# Altium schematic sheet chronos-core.SchDoc
size B; SheetNumber: 2; SheetTotal: 9
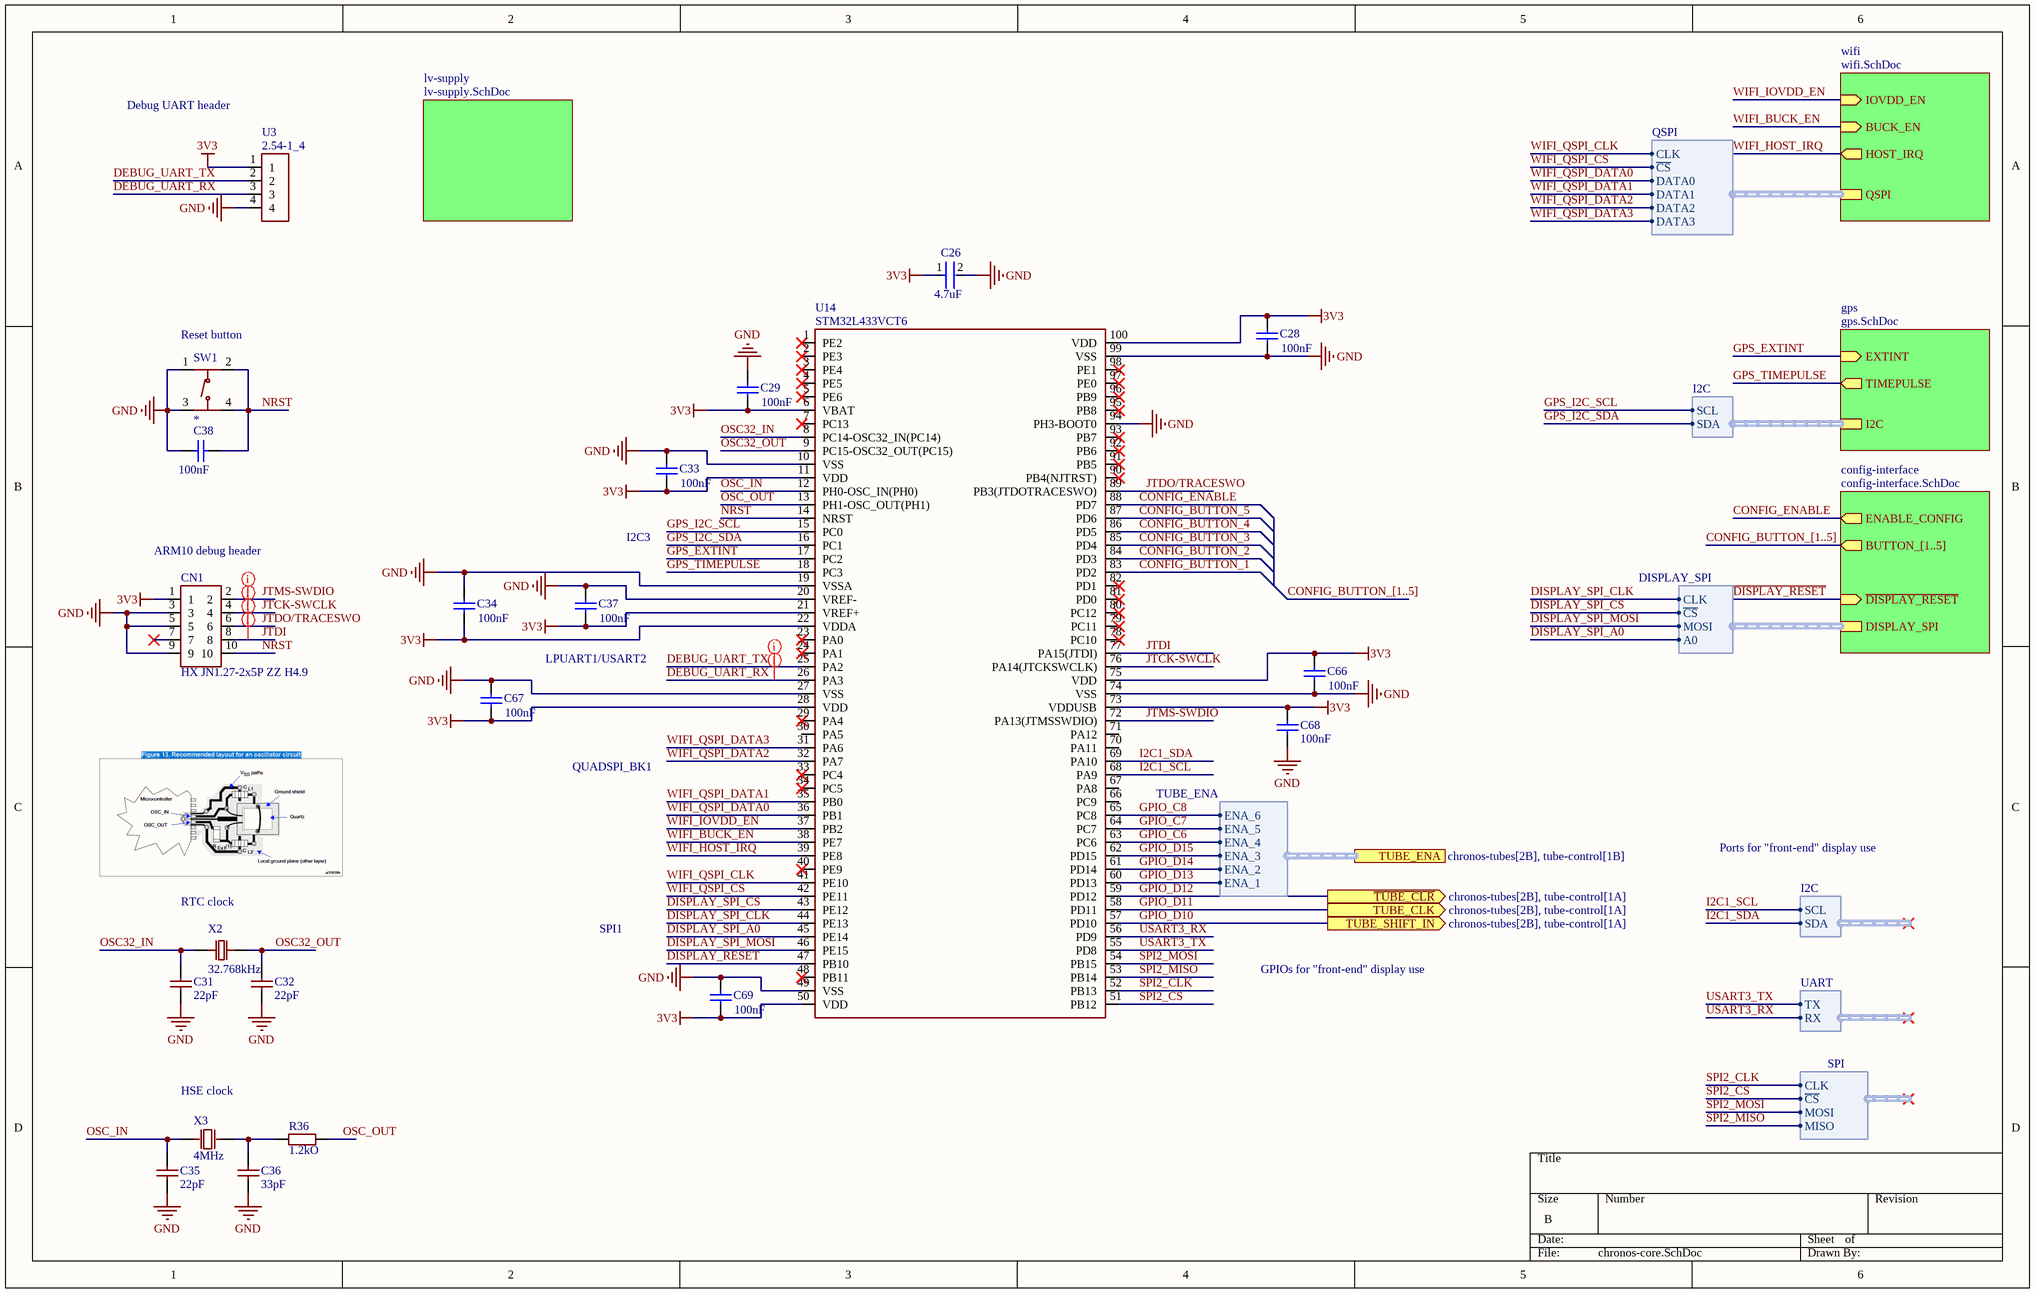
[diagram p0: chronos-core.SchDoc]

## Parts
C26  Capacitance: 4.7uF  [FP-CL282-IPC_C]  (hidden comment: CL05A475MP5NRNC)
C28  Capacitance: 100nF  [CAPC1050X55X23ML05T13]  (hidden comment: CL05B104KO5NNNC)
C29  Capacitance: 100nF  [CAPC1050X55X23ML05T13]  (hidden comment: CL05B104KO5NNNC)
C31  value 22pF  [0402CG220J500NT]  (hidden comment: 0402CG220J500NT)
C32  value 22pF  [0402CG220J500NT]  (hidden comment: 0402CG220J500NT)
C33  Capacitance: 100nF  [CAPC1050X55X23ML05T13]  (hidden comment: CL05B104KO5NNNC)
C34  Capacitance: 100nF  [CAPC1050X55X23ML05T13]  (hidden comment: CL05B104KO5NNNC)
C35  value 22pF  [0402CG220J500NT]  (hidden comment: 0402CG220J500NT)
C36  value 33pF  [0402CG330J500NT]  (hidden comment: 0402CG330J500NT)
C37  Capacitance: 100nF  [CAPC1050X55X23ML05T13]  (hidden comment: CL05B104KO5NNNC)
C38  Capacitance: 100nF  [CAPC1050X55X23ML05T13]  (hidden comment: CL05B104KO5NNNC)
C66  Capacitance: 100nF  [CAPC1050X55X23ML05T13]  (hidden comment: CL05B104KO5NNNC)
C67  Capacitance: 100nF  [CAPC1050X55X23ML05T13]  (hidden comment: CL05B104KO5NNNC)
C68  Capacitance: 100nF  [CAPC1050X55X23ML05T13]  (hidden comment: CL05B104KO5NNNC)
C69  Capacitance: 100nF  [CAPC1050X55X23ML05T13]  (hidden comment: CL05B104KO5NNNC)
CN1  HX JN1.27-2x5P ZZ H4.9  [HX JN1.27-2x5P ZZ H4.9]
R36  value 1.2kO  [0402WGF1201TCE]  (hidden comment: 0402WGF1201TCE)
SW1  TS-1187A-B-A-B  [TS-1187A-B-A-B]  (value not drawn)
U3  2.54-1_4  [2.54-1_4]
U14  STM32L433VCT6  [STM32L433VCT6]
X2  value 32.768kHz  [Q13FC13500004]  (hidden comment: Q13FC13500004)
X3  value 4MHz  [X49SM4MSD2SC]  (hidden comment: X49SM4MSD2SC)

## Sub-sheets
config-interface = config-interface.SchDoc: ENABLE_CONFIG (out), ~{DISPLAY_RESET} (in), DISPLAY_SPI (harness DISPLAY_SPI), BUTTON_[1..5] (out)
gps = gps.SchDoc: I2C (harness I2C), EXTINT (in), TIMEPULSE (out)
lv-supply = lv-supply.SchDoc: no entries
wifi = wifi.SchDoc: QSPI (harness QSPI), IOVDD_EN (in), BUCK_EN (in), HOST_IRQ (out)

## Ports
TUBE_CLK (out, see chronos-tubes[2B], tube-control[1A]), TUBE_ENA (harness TUBE_ENA, see chronos-tubes[2B], tube-control[1B]), TUBE_SHIFT_IN (out, see chronos-tubes[2B], tube-control[1A]), ~{TUBE_CLR} (out, see chronos-tubes[2B], tube-control[1A])

## Harnesses
QSPI: CLK, ~{CS}, DATA0, DATA1, DATA2, DATA3
I2C: SCL, SDA
DISPLAY_SPI: CLK, ~{CS}, MOSI, A0
UART: TX, RX
SPI: CLK, ~{CS}, MOSI, MISO
TUBE_ENA: ENA_1, ENA_2, ENA_3, ENA_4, ENA_5, ENA_6

## Nets
3V3: C26.1 C28.1 C29.1 C33.1 C34.1 C37.1 C66.1 C67.1 C68.1 C69.1 CN1.1 U3.1 U14.6(VBAT) U14.11(VDD) U14.21(VREF+) U14.22(VDDA) U14.28(VDD) U14.50(VDD) U14.73(VDDUSB) U14.75(VDD) U14.100(VDD)
GND: C26.2 C28.2 C29.2 C31.1 C32.1 C33.2 C34.2 C35.1 C36.1 C37.2 C38.2 C66.2 C67.2 C68.2 C69.2 CN1.3 CN1.5 CN1.9 SW1.1(A) SW1.3(C) U3.4 U14.10(VSS) U14.19(VSSA) U14.20(VREF-) U14.27(VSS) U14.49(VSS) U14.74(VSS) U14.94(PH3-BOOT0) U14.99(VSS)
~{DISPLAY_RESET}: U14.47(PB10) ; sheet config-interface/~{DISPLAY_RESET}
~{DISPLAY_SPI_CS}: U14.43(PE12) ; sheet config-interface/DISPLAY_SPI.~{CS}
~{SPI2_CS}: U14.51(PB12) ; harness SPI.~{CS}
~{WIFI_QSPI_CS}: U14.42(PE11) ; sheet wifi/QSPI.~{CS}
CONFIG_BUTTON_1: U14.83(PD2)
CONFIG_BUTTON_2: U14.84(PD3)
CONFIG_BUTTON_3: U14.85(PD4)
CONFIG_BUTTON_4: U14.86(PD5)
CONFIG_BUTTON_5: U14.87(PD6)
CONFIG_ENABLE: U14.88(PD7) ; sheet config-interface/ENABLE_CONFIG
DEBUG_UART_RX: U3.3 U14.26(PA3)
DEBUG_UART_TX: U3.2 U14.25(PA2)
DISPLAY_SPI_A0: U14.45(PE14) ; sheet config-interface/DISPLAY_SPI.A0
DISPLAY_SPI_CLK: U14.44(PE13) ; sheet config-interface/DISPLAY_SPI.CLK
DISPLAY_SPI_MOSI: U14.46(PE15) ; sheet config-interface/DISPLAY_SPI.MOSI
GPIO_C6: U14.63(PC6) ; port TUBE_ENA.ENA_4
GPIO_C7: U14.64(PC7) ; port TUBE_ENA.ENA_5
GPIO_C8: U14.65(PC8) ; port TUBE_ENA.ENA_6
GPIO_D10: U14.57(PD10) ; port TUBE_SHIFT_IN
GPIO_D11: U14.58(PD11) ; port TUBE_CLK
GPIO_D12: U14.59(PD12) ; port ~{TUBE_CLR}
GPIO_D13: U14.60(PD13) ; port TUBE_ENA.ENA_1
GPIO_D14: U14.61(PD14) ; port TUBE_ENA.ENA_2
GPIO_D15: U14.62(PD15) ; port TUBE_ENA.ENA_3
GPS_EXTINT: U14.17(PC2) ; sheet gps/EXTINT
GPS_I2C_SCL: U14.15(PC0) ; sheet gps/I2C.SCL
GPS_I2C_SDA: U14.16(PC1) ; sheet gps/I2C.SDA
GPS_TIMEPULSE: U14.18(PC3) ; sheet gps/TIMEPULSE
I2C1_SCL: U14.68(PA9) ; harness I2C.SCL
I2C1_SDA: U14.69(PA10) ; harness I2C.SDA
JTCK-SWCLK: CN1.4 U14.76(PA14(JTCKSWCLK))
JTDI: CN1.8 U14.77(PA15(JTDI))
JTDO/TRACESWO: CN1.6 U14.89(PB3(JTDOTRACESWO))
JTMS-SWDIO: CN1.2 U14.72(PA13(JTMSSWDIO))
NRST: C38.1 CN1.10 SW1.2(B) SW1.4(D) U14.14(NRST)
OSC32_IN: C31.2 U14.8(PC14-OSC32_IN(PC14)) X2.2
OSC32_OUT: C32.2 U14.9(PC15-OSC32_OUT(PC15)) X2.1
OSC_IN: C35.2 U14.12(PH0-OSC_IN(PH0)) X3.1(OSC1)
OSC_OUT: R36.2 U14.13(PH1-OSC_OUT(PH1))
SPI2_CLK: U14.52(PB13) ; harness SPI.CLK
SPI2_MISO: U14.53(PB14) ; harness SPI.MISO
SPI2_MOSI: U14.54(PB15) ; harness SPI.MOSI
USART3_RX: U14.56(PD9) ; harness UART.RX
USART3_TX: U14.55(PD8) ; harness UART.TX
WIFI_BUCK_EN: U14.38(PE7) ; sheet wifi/BUCK_EN
WIFI_HOST_IRQ: U14.39(PE8) ; sheet wifi/HOST_IRQ
WIFI_IOVDD_EN: U14.37(PB2) ; sheet wifi/IOVDD_EN
WIFI_QSPI_CLK: U14.41(PE10) ; sheet wifi/QSPI.CLK
WIFI_QSPI_DATA0: U14.36(PB1) ; sheet wifi/QSPI.DATA0
WIFI_QSPI_DATA1: U14.35(PB0) ; sheet wifi/QSPI.DATA1
WIFI_QSPI_DATA2: U14.32(PA7) ; sheet wifi/QSPI.DATA2
WIFI_QSPI_DATA3: U14.31(PA6) ; sheet wifi/QSPI.DATA3
NetC36_2: C36.2 R36.1 X3.2(OSC2)

Not connected (* = marked no-connect by the designer): CN1 7*; U14 1(PE2)* 2(PE3)* 3(PE4)* 4(PE5)* 5(PE6)* 7(PC13)* 23(PA0)* 24(PA1)* 29(PA4)* 30(PA5) 33(PC4)* 34(PC5)* 40(PE9)* 48(PB11)* 66(PC9) 67(PA8) 70(PA11) 71(PA12) 78(PC10)* 79(PC11)* 80(PC12)* 81(PD0)* 82(PD1)* 90(PB4(NJTRST))* 91(PB5)* 92(PB6)* 93(PB7)* 95(PB8)* 96(PB9)* 97(PE0)* 98(PE1)*

## Buses and harness runs
bus CONFIG_BUTTON_[1..5]
bus CONFIG_BUTTON_[1..5] = sheet config-interface/BUTTON_[1..5]

## Layout directives
net class DEBUG_UART: DEBUG_UART_RX, DEBUG_UART_TX
net class DEBUG: JTCK-SWCLK, JTDI, JTDO/TRACESWO, JTMS-SWDIO

## Notes on the sheet
- Debug UART header
- (near SW1) Reset button
- (near CN1) ARM10 debug header
- I2C3
- LPUART1/USART2
- QUADSPI_BK1
- (near X2) RTC clock
- Ports for "front-end" display use
- SPI1
- GPIOs for "front-end" display use
- (near X3) HSE clock

## Library data of the parts
C26 = CMP-13271-000548-1: Cap Ceramic 4.7uF 10V X5R ±20% SMD 0402 +85°C Paper T/R; Max Operating Temperature: 85°C; Lead Free: Lead Free; Tolerance: 20%; Voltage Rating: 10V; Dielectric: X5R; Width: 0.02inch; Length: 0.039inch; Case/Package: 0402; Min Operating Temperature: -55°C; Packaging: Tape and Reel; Thickness: 0.022inch; Case Code (Imperial): 0402; Package Quantity: 10000; Case Code (Metric): 1005; Mount: Surface Mount
C28 C29 C33 C34 C37 C38 C66-C69 = CMP-2000-05439-1: Chip Capacitor, 100 nF, +/- 10%, 16 V, -55 to 125 degC, 0402 (1005 Metric), RoHS, Tape and Reel; Manufacturer: Samsung Electro-Mechanics; Dielectric: X7R; Rated Voltage: 16V; Case Size/Dimension: 0402; Tolerance (%): ±10%; Manufacturer URL: http://www.samsungsem.com/global/index.jsp; Datasheet URL: https://datasheet.ciiva.com/29198/458718-da-01-en-vs-kondensator-0402-29198423.pdf; Datasheet Version: Nov-10
C31 C32 C35 = 0402CG220J500NT: Multilayer Ceramic Capacitors MLCC - SMD/SMT. 22pF 50V C0G +/-5% 0402 Multilayer Ceramic Capacitors MLCC - SMD/SMT ROHS; Manufacturer: FH (Guangdong Fenghua Advanced Tech); Component Type: Capacitors; Design Item ID: 0402CG220J500NT; JLCPCB Part #: C1555; Manufacturer Part Number: 0402CG220J500NT
C36 = 0402CG330J500NT: Multilayer Ceramic Capacitors MLCC - SMD/SMT. 33pF 50V C0G +/-5% 0402 Multilayer Ceramic Capacitors MLCC - SMD/SMT ROHS; Manufacturer: FH (Guangdong Fenghua Advanced Tech); Component Type: Capacitors; Design Item ID: 0402CG330J500NT; JLCPCB Part #: C1562; Manufacturer Part Number: 0402CG330J500NT
CN1 = HX JN1.27-2x5P ZZ H4.9: IDC Connectors. -40C~+105C 1.27mm 1.27mm 1A 2 2x5P 5 500V Black Copper Gold IDC Header Through Hole Plugin,P=1.27mm IDC Connectors ROHS; Manufacturer: hanxia; Component Type: Connectors; Design Item ID: HX JN1.27-2x5P ZZ H4.9; Value: HX JN1.27-2x5P ZZ H4.9; JLCPCB Part #: C42372547; Manufacturer Part Number: HX JN1.27-2x5P ZZ H4.9
R36 = 0402WGF1201TCE: Resistors. -55C~+155C 1.2kohm 50V 62.5mW Thick Film Resistor +/-1% +/-100ppm/C 0402 Chip Resistor - Surface Mount ROHS; Manufacturer: UNI-ROYAL(Uniroyal Elec); Component Type: Resistors; Design Item ID: 0402WGF1201TCE; JLCPCB Part #: C25862; Manufacturer Part Number: 0402WGF1201TCE
SW1 = TS-1187A-B-A-B: Tactile Switches. -30C~+85C 1.5mm 1.6N 100,000 cycles 12V 5.1mm 5.1mm 50mA Gold No Round Button SPST Surface Mount,Vertical Without Bracket SMD-4P,5.1x5.1mm Tactile Switches ROHS; Manufacturer: XKB Connection; Component Type: Switches; Design Item ID: TS-1187A-B-A-B; Value: *; JLCPCB Part #: C318884; Manufacturer Part Number: TS-1187A-B-A-B
U3 = 2.54-1_4: Pin Headers. -40C~+105C 1 1x4P 2.54mm 2.54mm 2.5A 3mm 4P 6mm Brass Gold Pin Header Through Hole ,P=2.54mm Pin Headers ROHS; Manufacturer Part Number: 2.54-1*4; Manufacturer: ZHOURI; Component Type: Integrated Circuits; Design Item ID: 2.54-1_4; Value: *; JLCPCB Part #: C5116483
U14 = STM32L433VCT6: ST Microelectronics. -40C~+85C 1.71V~3.6V 12bit 12bit 256KB 32 Bit 64KB 80MHz 83 ARM Cortex-M4 Built-in FLASH LQFP-100(14x14) Microcontrollers (MCU/MPU/SOC) ROHS; Component Type: Integrated Circuits; Design Item ID: STM32L433VCT6; Value: *; JLCPCB Part #: C915966; Manufacturer Part Number: STM32L433VCT6; Manufacturer: STMicroelectronics
X2 = Q13FC13500004: Crystals. -40C~+85C 12.5pF 32.768kHz 70kohm Crystal Oscillator +/-20ppm SMD3215-2P Crystals ROHS; Manufacturer: Seiko Epson; Component Type: Crystal Oscillators; Design Item ID: Q13FC13500004; JLCPCB Part #: C32346; Manufacturer Part Number: Q13FC13500004
X3 = X49SM4MSD2SC: Crystals. -20C~+70C 120ohm 20pF 4MHz Crystal Oscillator +/-20ppm +/-30ppm HC-49S-SMD Crystals ROHS; Manufacturer: YXC Crystal Oscillators; Component Type: Crystal Oscillators; Design Item ID: X49SM4MSD2SC; JLCPCB Part #: C13774; Manufacturer Part Number: X49SM4MSD2SC